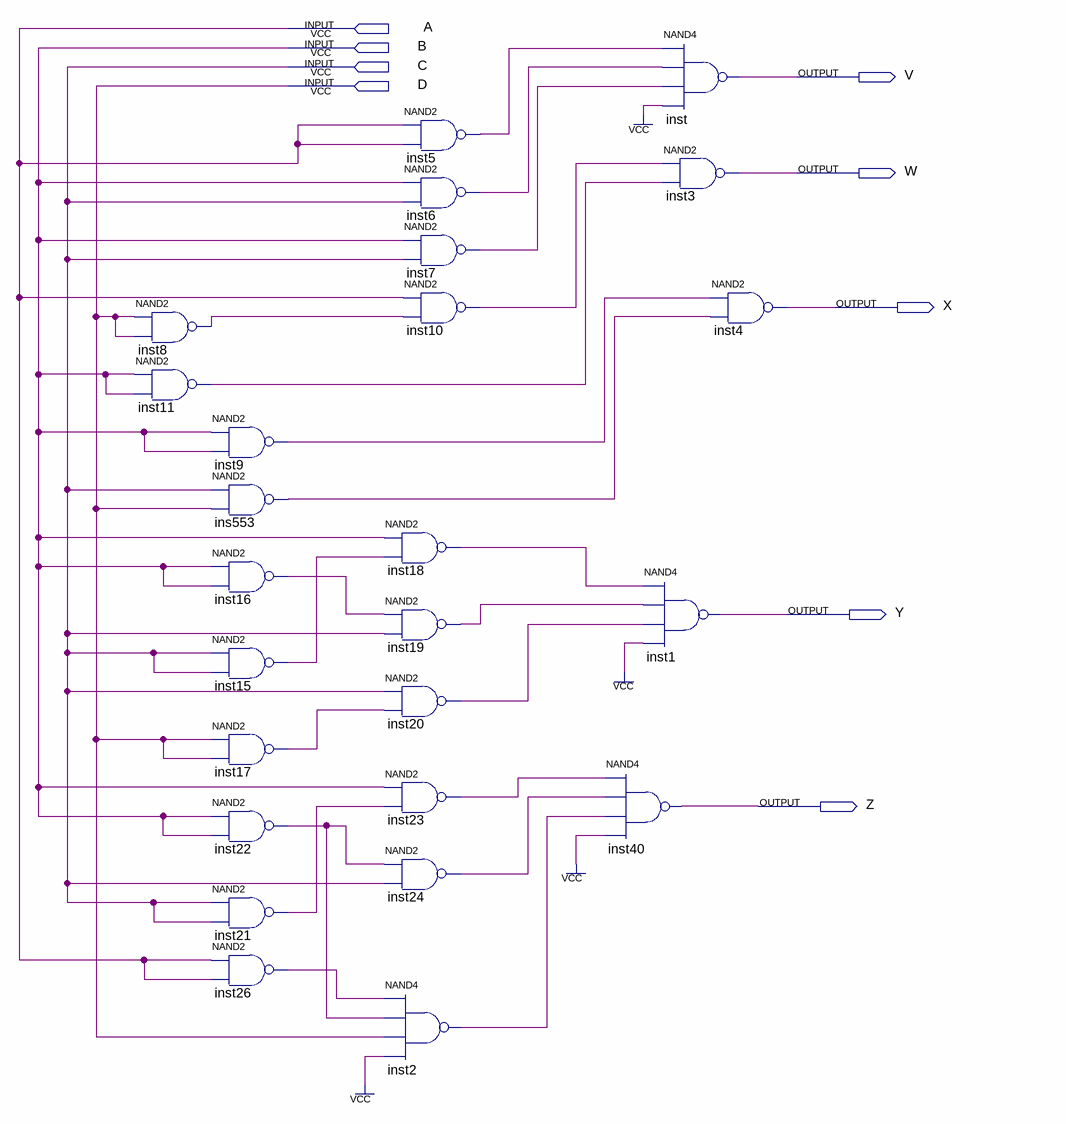
[diagram p0: schematic sheet]
// Quartus schematic nands.bdf as structural Verilog: 25 symbols, 9 pins
module nands (
  input  A,
  input  B,
  input  C,
  input  D,
  output V,
  output W,
  output X,
  output Y,
  output Z
);

  wire ins553_out, inst2_out, inst5_out, inst6_out, inst7_out, inst8_out, inst9_out, inst10_out, inst11_out,
       inst15_out, inst16_out, inst17_out, inst18_out, inst19_out, inst20_out, inst21_out, inst22_out,
       inst23_out, inst24_out, inst26_out;

  nand inst8 (inst8_out, D, D);
  nand inst11 (inst11_out, B, B);
  nand inst9 (inst9_out, B, B);
  nand ins553 (ins553_out, C, D);
  nand inst16 (inst16_out, B, B);
  nand inst15 (inst15_out, C, C);
  nand inst17 (inst17_out, D, D);
  nand inst22 (inst22_out, B, B);
  nand inst21 (inst21_out, C, C);
  nand inst26 (inst26_out, A, A);
  nand inst5 (inst5_out, A, A);
  nand inst6 (inst6_out, B, C);
  nand inst7 (inst7_out, B, C);
  nand inst10 (inst10_out, A, inst8_out);
  nand inst18 (inst18_out, B, inst15_out);
  nand inst19 (inst19_out, inst16_out, C);
  nand inst20 (inst20_out, C, inst17_out);
  nand inst23 (inst23_out, B, inst21_out);
  nand inst24 (inst24_out, inst22_out, C);
  nand inst2 (inst2_out, inst26_out, inst22_out, D, 1'b1);
  nand inst1 (Y, inst18_out, inst19_out, inst20_out, 1'b1);
  nand inst40 (Z, inst23_out, inst24_out, inst2_out, 1'b1);
  nand inst (V, inst5_out, inst6_out, inst7_out, 1'b1);
  nand inst3 (W, inst10_out, inst11_out);
  nand inst4 (X, inst9_out, ins553_out);
endmodule
